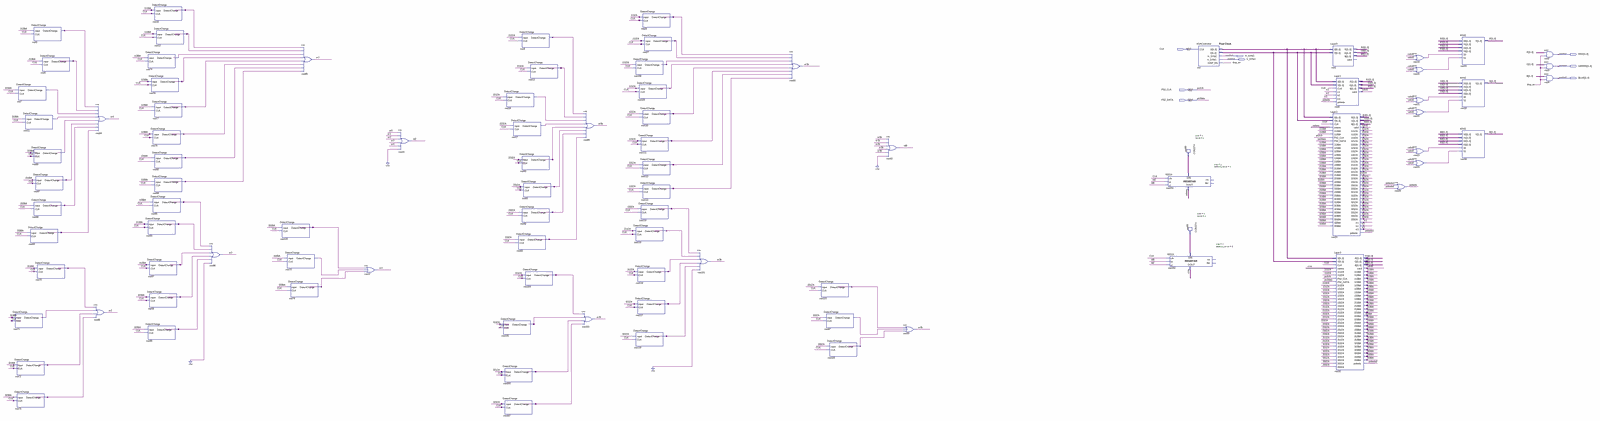
[diagram p0: schematic sheet, whole]
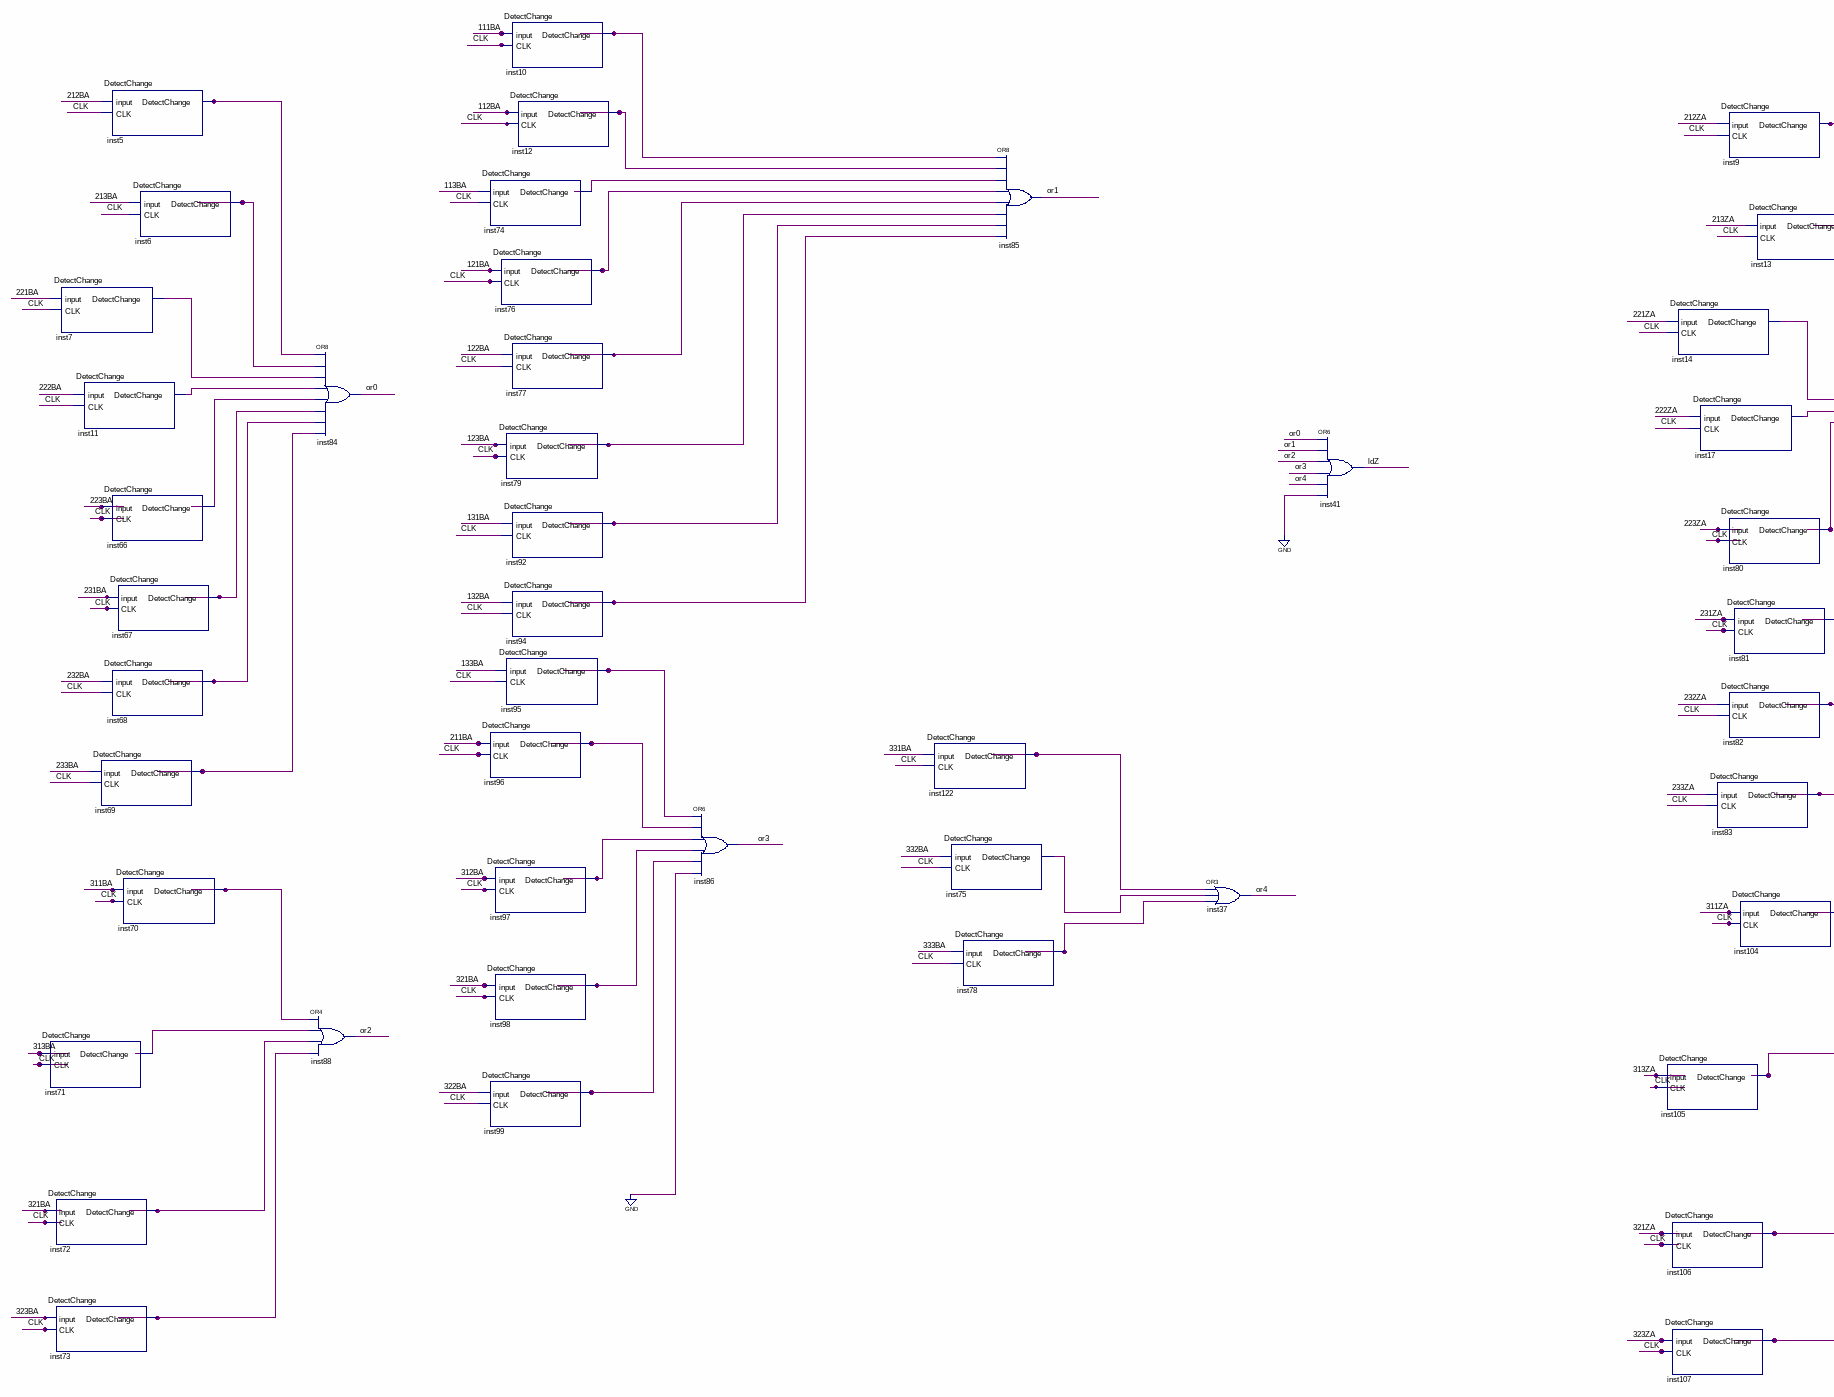
[diagram p1: schematic sheet, left part]
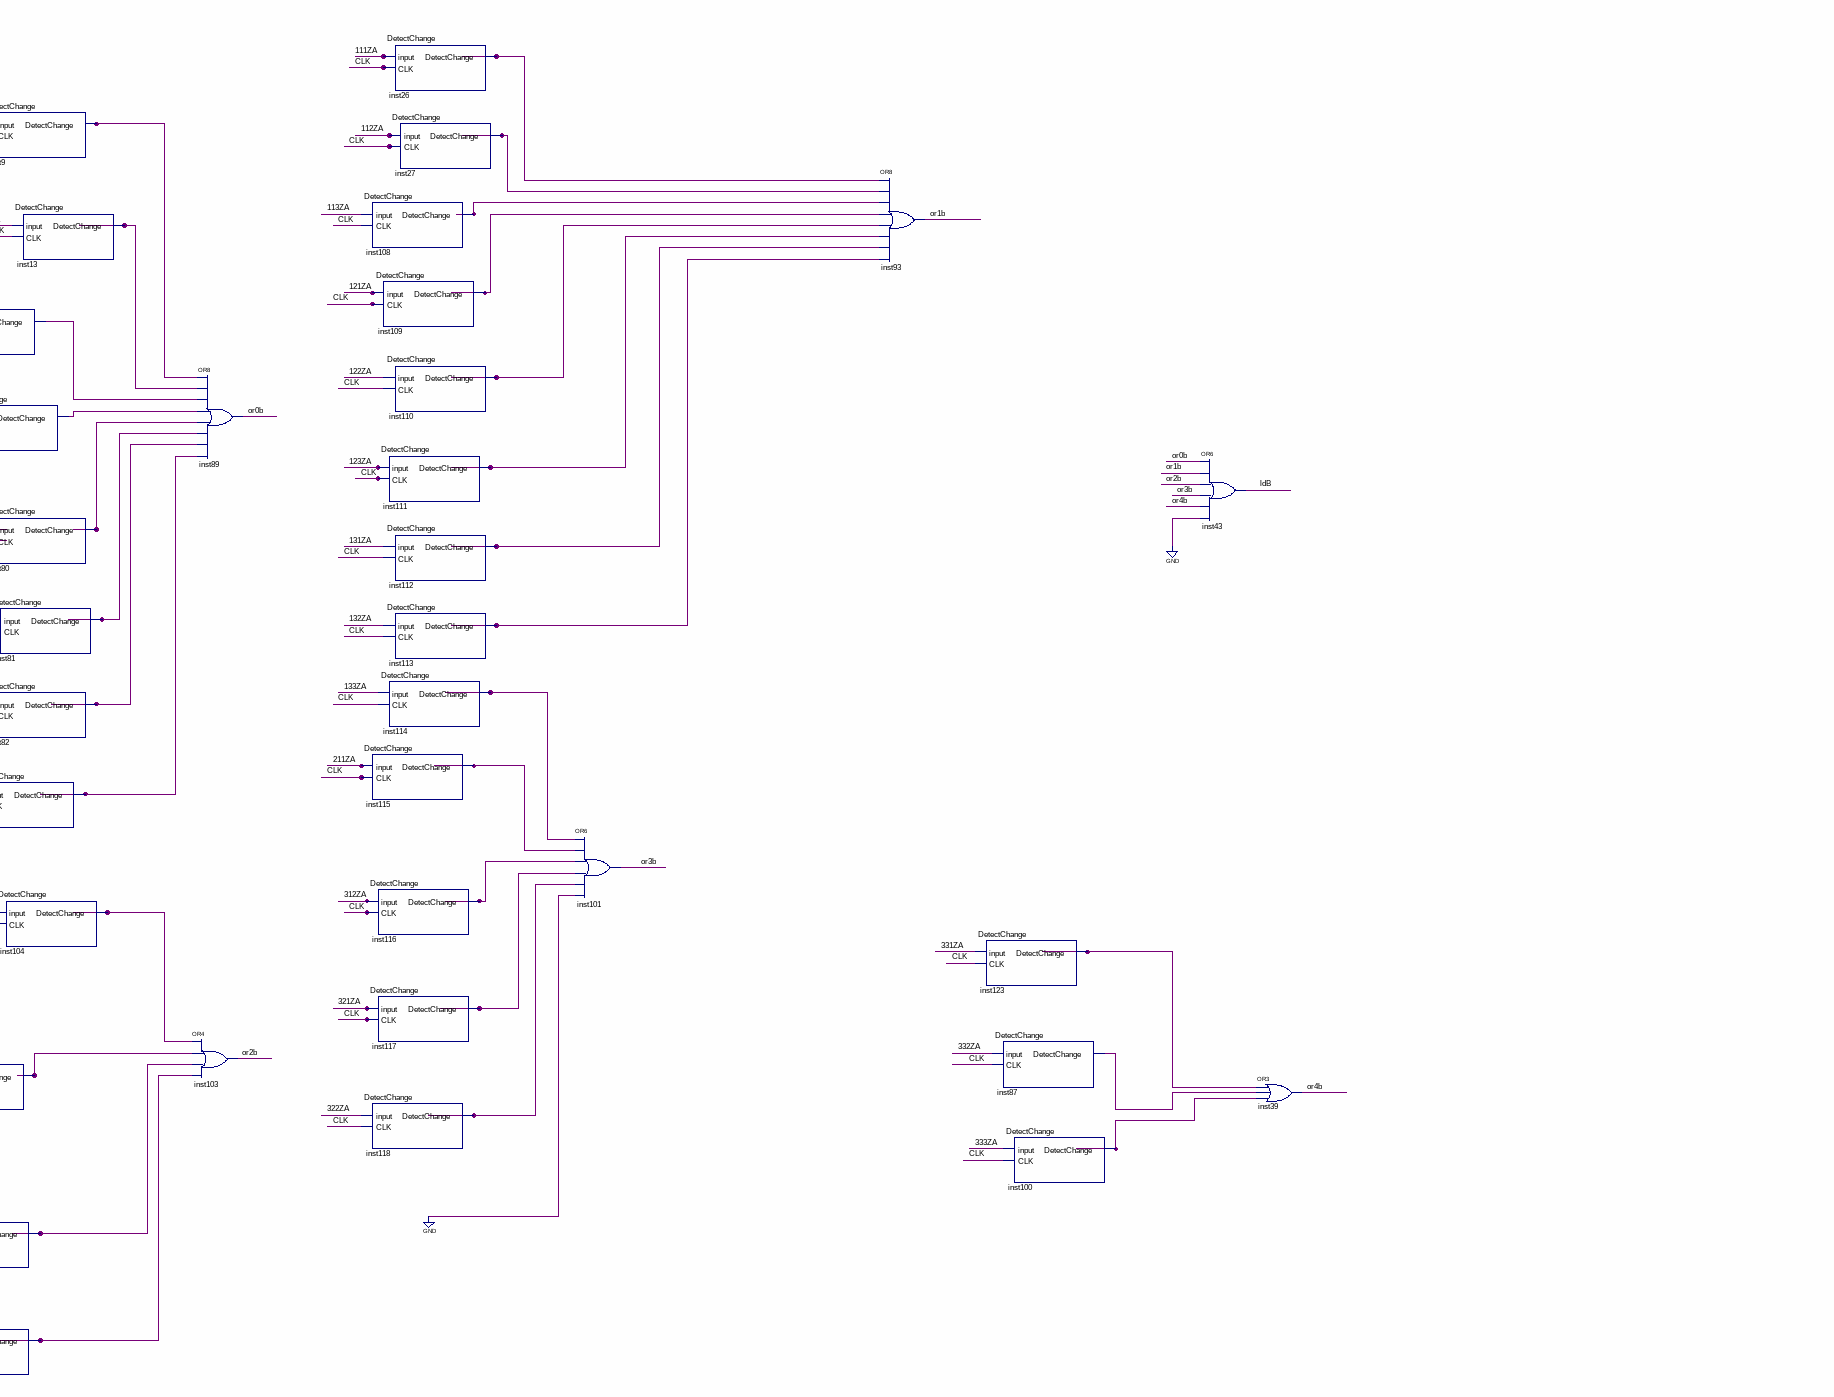
[diagram p2: schematic sheet, centre part]
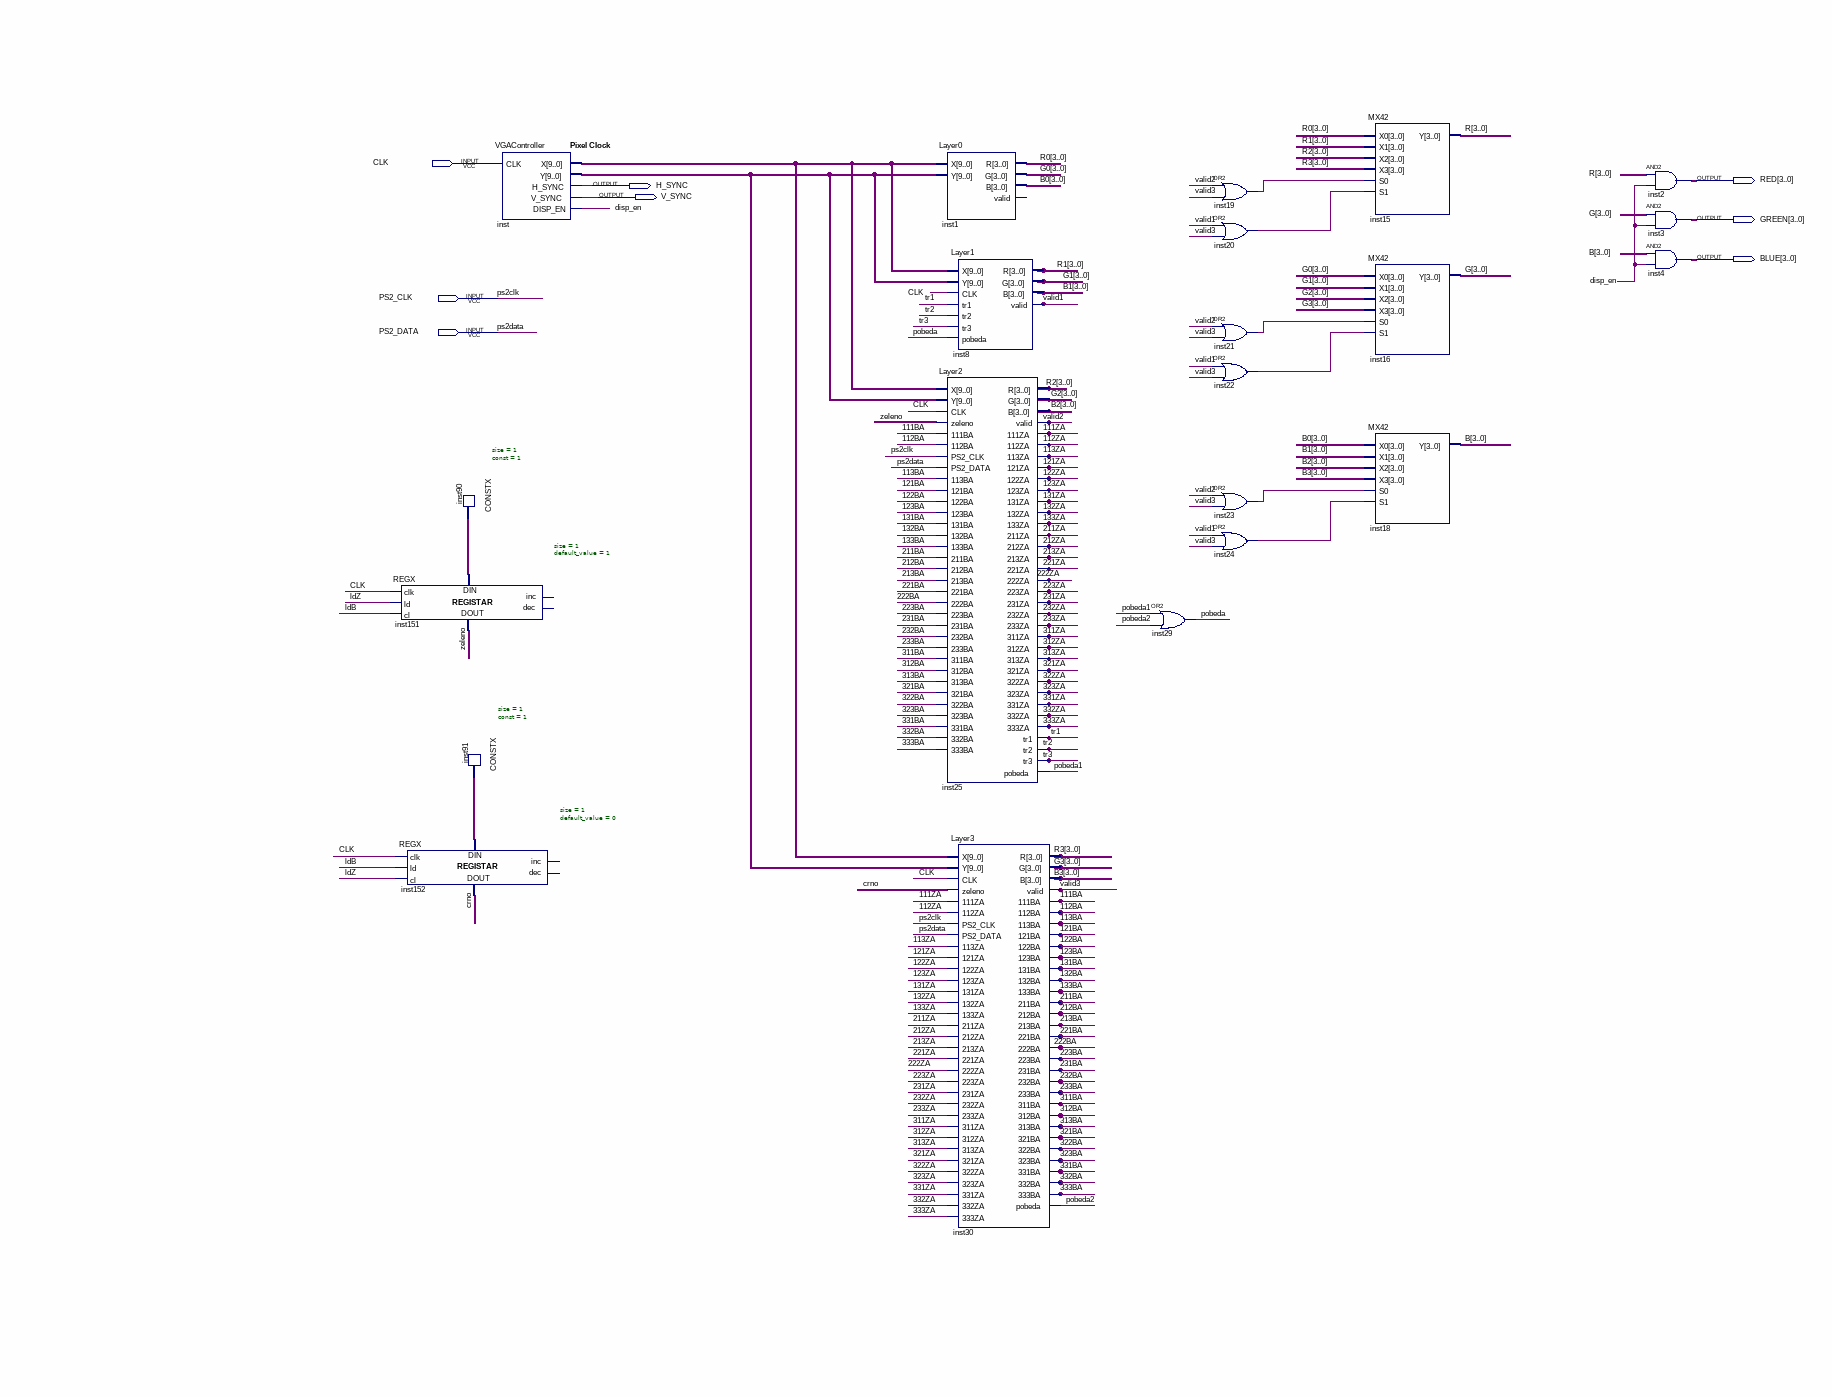
[diagram p3: schematic sheet, right part]
// Quartus schematic Lab2Demo.bdf as structural Verilog: 90 symbols, 8 pins
module Lab2Demo (
  input  CLK,
  input  PS2_CLK,
  input  PS2_DATA,
  output [3:0] RED,
  output H_SYNC,
  output V_SYNC,
  output [3:0] GREEN,
  output [3:0] BLUE
);

  wire \111BA , \111ZA , \112BA , \112ZA , \113BA , \113ZA , \121BA , \121ZA , \122BA , \122ZA , \123BA ,
       \123ZA , \131BA , \131ZA , \132BA , \132ZA , \133BA , \133ZA , \211BA , \211ZA , \212BA , \212ZA ,
       \213BA , \213ZA , \221BA , \221ZA , \222BA , \222ZA , \223BA , \223ZA , \231BA , \231ZA , \232BA ,
       \232ZA , \233BA , \233ZA , \311BA , \311ZA , \312BA , \312ZA , \313BA , \313ZA , \321BA , \321ZA ,
       \322BA , \322ZA , \323BA , \323ZA , \331BA , \331ZA , \332BA , \332ZA , \333BA , \333ZA , crno,
       disp_en, inst5_detectchange, inst6_detectchange, inst7_detectchange, inst9_detectchange,
       inst10_detectchange, inst11_detectchange, inst12_detectchange, inst13_detectchange,
       inst14_detectchange, inst17_detectchange, inst19_out, inst20_out, inst21_out, inst22_out, inst23_out,
       inst24_out, inst26_detectchange, inst27_detectchange, inst66_detectchange, inst67_detectchange,
       inst68_detectchange, inst69_detectchange, inst70_detectchange, inst71_detectchange,
       inst72_detectchange, inst73_detectchange, inst74_detectchange, inst75_detectchange,
       inst76_detectchange, inst77_detectchange, inst78_detectchange, inst79_detectchange,
       inst80_detectchange, inst81_detectchange, inst82_detectchange, inst83_detectchange,
       inst87_detectchange, inst90_data, inst91_data, inst92_detectchange, inst94_detectchange,
       inst95_detectchange, inst96_detectchange, inst97_detectchange, inst98_detectchange,
       inst99_detectchange, inst100_detectchange, inst104_detectchange, inst105_detectchange,
       inst106_detectchange, inst107_detectchange, inst108_detectchange, inst109_detectchange,
       inst110_detectchange, inst111_detectchange, inst112_detectchange, inst113_detectchange,
       inst114_detectchange, inst115_detectchange, inst116_detectchange, inst117_detectchange,
       inst118_detectchange, inst122_detectchange, inst123_detectchange, ldB, ldZ, or0, or0b, or1, or1b, or2,
       or2b, or3, or3b, or4, or4b, pobeda, pobeda1, pobeda2, tr1, tr2, tr3, valid1, valid2, valid3, zeleno;
  wire [3:0] B, B0, B1, B2, B3, G, G0, G1, G2, G3, R, R0, R1, R2, R3;
  wire [9:0] inst_x, inst_y;

  DetectChange inst71 (.\input (\313BA ), .CLK(CLK), .DetectChange(inst71_detectchange));
  DetectChange inst7 (.\input (\221BA ), .CLK(CLK), .DetectChange(inst7_detectchange));
  DetectChange inst11 (.\input (\222BA ), .CLK(CLK), .DetectChange(inst11_detectchange));
  DetectChange inst72 (.\input (\321BA ), .CLK(CLK), .DetectChange(inst72_detectchange));
  DetectChange inst73 (.\input (\323BA ), .CLK(CLK), .DetectChange(inst73_detectchange));
  DetectChange inst5 (.\input (\212BA ), .CLK(CLK), .DetectChange(inst5_detectchange));
  DetectChange inst6 (.\input (\213BA ), .CLK(CLK), .DetectChange(inst6_detectchange));
  DetectChange inst66 (.\input (\223BA ), .CLK(CLK), .DetectChange(inst66_detectchange));
  DetectChange inst67 (.\input (\231BA ), .CLK(CLK), .DetectChange(inst67_detectchange));
  DetectChange inst68 (.\input (\232BA ), .CLK(CLK), .DetectChange(inst68_detectchange));
  DetectChange inst69 (.\input (\233BA ), .CLK(CLK), .DetectChange(inst69_detectchange));
  DetectChange inst70 (.\input (\311BA ), .CLK(CLK), .DetectChange(inst70_detectchange));
  or inst88 (or2, inst70_detectchange, inst71_detectchange, inst72_detectchange, inst73_detectchange);
  or inst84 (or0, inst5_detectchange, inst6_detectchange, inst7_detectchange, inst11_detectchange, inst66_detectchange, inst67_detectchange, inst68_detectchange, inst69_detectchange);
  DetectChange inst74 (.\input (\113BA ), .CLK(CLK), .DetectChange(inst74_detectchange));
  DetectChange inst76 (.\input (\121BA ), .CLK(CLK), .DetectChange(inst76_detectchange));
  DetectChange inst96 (.\input (\211BA ), .CLK(CLK), .DetectChange(inst96_detectchange));
  DetectChange inst97 (.\input (\312BA ), .CLK(CLK), .DetectChange(inst97_detectchange));
  DetectChange inst98 (.\input (\321BA ), .CLK(CLK), .DetectChange(inst98_detectchange));
  DetectChange inst99 (.\input (\322BA ), .CLK(CLK), .DetectChange(inst99_detectchange));
  DetectChange inst10 (.\input (\111BA ), .CLK(CLK), .DetectChange(inst10_detectchange));
  DetectChange inst12 (.\input (\112BA ), .CLK(CLK), .DetectChange(inst12_detectchange));
  DetectChange inst77 (.\input (\122BA ), .CLK(CLK), .DetectChange(inst77_detectchange));
  DetectChange inst79 (.\input (\123BA ), .CLK(CLK), .DetectChange(inst79_detectchange));
  DetectChange inst92 (.\input (\131BA ), .CLK(CLK), .DetectChange(inst92_detectchange));
  DetectChange inst94 (.\input (\132BA ), .CLK(CLK), .DetectChange(inst94_detectchange));
  DetectChange inst95 (.\input (\133BA ), .CLK(CLK), .DetectChange(inst95_detectchange));
  or inst86 (or3, inst95_detectchange, inst96_detectchange, inst97_detectchange, inst98_detectchange, inst99_detectchange, 1'b0);
  DetectChange inst122 (.\input (\331BA ), .CLK(CLK), .DetectChange(inst122_detectchange));
  DetectChange inst75 (.\input (\332BA ), .CLK(CLK), .DetectChange(inst75_detectchange));
  DetectChange inst78 (.\input (\333BA ), .CLK(CLK), .DetectChange(inst78_detectchange));
  or inst85 (or1, inst10_detectchange, inst12_detectchange, inst74_detectchange, inst76_detectchange, inst77_detectchange, inst79_detectchange, inst92_detectchange, inst94_detectchange);
  or inst37 (or4, inst122_detectchange, inst75_detectchange, inst78_detectchange);
  or inst41 (ldZ, or0, or1, or2, or3, or4, 1'b0);
  DetectChange inst105 (.\input (\313ZA ), .CLK(CLK), .DetectChange(inst105_detectchange));
  DetectChange inst106 (.\input (\321ZA ), .CLK(CLK), .DetectChange(inst106_detectchange));
  DetectChange inst107 (.\input (\323ZA ), .CLK(CLK), .DetectChange(inst107_detectchange));
  DetectChange inst14 (.\input (\221ZA ), .CLK(CLK), .DetectChange(inst14_detectchange));
  DetectChange inst17 (.\input (\222ZA ), .CLK(CLK), .DetectChange(inst17_detectchange));
  DetectChange inst83 (.\input (\233ZA ), .CLK(CLK), .DetectChange(inst83_detectchange));
  DetectChange inst9 (.\input (\212ZA ), .CLK(CLK), .DetectChange(inst9_detectchange));
  DetectChange inst13 (.\input (\213ZA ), .CLK(CLK), .DetectChange(inst13_detectchange));
  DetectChange inst80 (.\input (\223ZA ), .CLK(CLK), .DetectChange(inst80_detectchange));
  DetectChange inst81 (.\input (\231ZA ), .CLK(CLK), .DetectChange(inst81_detectchange));
  DetectChange inst82 (.\input (\232ZA ), .CLK(CLK), .DetectChange(inst82_detectchange));
  DetectChange inst104 (.\input (\311ZA ), .CLK(CLK), .DetectChange(inst104_detectchange));
  or inst89 (or0b, inst9_detectchange, inst13_detectchange, inst14_detectchange, inst17_detectchange, inst80_detectchange, inst81_detectchange, inst82_detectchange, inst83_detectchange);
  or inst103 (or2b, inst104_detectchange, inst105_detectchange, inst106_detectchange, inst107_detectchange);
  DetectChange inst108 (.\input (\113ZA ), .CLK(CLK), .DetectChange(inst108_detectchange));
  DetectChange inst109 (.\input (\121ZA ), .CLK(CLK), .DetectChange(inst109_detectchange));
  DetectChange inst111 (.\input (\123ZA ), .CLK(CLK), .DetectChange(inst111_detectchange));
  DetectChange inst114 (.\input (\133ZA ), .CLK(CLK), .DetectChange(inst114_detectchange));
  DetectChange inst115 (.\input (\211ZA ), .CLK(CLK), .DetectChange(inst115_detectchange));
  DetectChange inst116 (.\input (\312ZA ), .CLK(CLK), .DetectChange(inst116_detectchange));
  DetectChange inst117 (.\input (\321ZA ), .CLK(CLK), .DetectChange(inst117_detectchange));
  DetectChange inst118 (.\input (\322ZA ), .CLK(CLK), .DetectChange(inst118_detectchange));
  DetectChange inst26 (.\input (\111ZA ), .CLK(CLK), .DetectChange(inst26_detectchange));
  DetectChange inst27 (.\input (\112ZA ), .CLK(CLK), .DetectChange(inst27_detectchange));
  DetectChange inst110 (.\input (\122ZA ), .CLK(CLK), .DetectChange(inst110_detectchange));
  DetectChange inst112 (.\input (\131ZA ), .CLK(CLK), .DetectChange(inst112_detectchange));
  DetectChange inst113 (.\input (\132ZA ), .CLK(CLK), .DetectChange(inst113_detectchange));
  or inst101 (or3b, inst114_detectchange, inst115_detectchange, inst116_detectchange, inst117_detectchange, inst118_detectchange, 1'b0);
  or inst93 (or1b, inst26_detectchange, inst27_detectchange, inst108_detectchange, inst109_detectchange, inst110_detectchange, inst111_detectchange, inst112_detectchange, inst113_detectchange);
  DetectChange inst123 (.\input (\331ZA ), .CLK(CLK), .DetectChange(inst123_detectchange));
  DetectChange inst87 (.\input (\332ZA ), .CLK(CLK), .DetectChange(inst87_detectchange));
  DetectChange inst100 (.\input (\333ZA ), .CLK(CLK), .DetectChange(inst100_detectchange));
  or inst43 (ldB, or0b, or1b, or2b, or3b, or4b, 1'b0);
  or inst39 (or4b, inst123_detectchange, inst87_detectchange, inst100_detectchange);
  REGX #(.size(1), .default_value(1)) inst151 (
    .clk(CLK), .ld(ldZ), .cl(ldB), .data_in(inst90_data), .data_out(zeleno));  // open: inc, dec
  REGX #(.size(1), .default_value(0)) inst152 (
    .clk(CLK), .ld(ldB), .cl(ldZ), .data_in(inst91_data), .data_out(crno));  // open: inc, dec
  VGAController inst (.CLK(CLK), .X(inst_x), .Y(inst_y), .H_SYNC(H_SYNC), .V_SYNC(V_SYNC), .DISP_EN(disp_en));
  CONSTX #(.size(1), .\const (1)) inst90 (.data(inst90_data));
  CONSTX #(.size(1), .\const (1)) inst91 (.data(inst91_data));
  Layer0 inst1 (.X(inst_x), .Y(inst_y), .R(R0), .G(G0), .B(B0));  // open: valid
  Layer2 inst25 (
    .X(inst_x), .Y(inst_y), .CLK(CLK), .zeleno(zeleno), .\111BA (\111BA ), .\112BA (\112BA ),
    .PS2_CLK(PS2_CLK), .PS2_DATA(PS2_DATA), .\113BA (\113BA ), .\121BA (\121BA ), .\122BA (\122BA ),
    .\123BA (\123BA ), .\131BA (\131BA ), .\132BA (\132BA ), .\133BA (\133BA ), .\211BA (\211BA ),
    .\212BA (\212BA ), .\213BA (\213BA ), .\221BA (\221BA ), .\222BA (\222BA ), .\223BA (\223BA ),
    .\231BA (\231BA ), .\232BA (\232BA ), .\233BA (\233BA ), .\311BA (\311BA ), .\312BA (\312BA ),
    .\313BA (\313BA ), .\321BA (\321BA ), .\322BA (\322BA ), .\323BA (\323BA ), .\331BA (\331BA ),
    .\332BA (\332BA ), .\333BA (\333BA ), .R(R2), .G(G2), .B(B2), .valid(valid2), .\111ZA (\111ZA ),
    .\112ZA (\112ZA ), .\113ZA (\113ZA ), .\121ZA (\121ZA ), .\122ZA (\122ZA ), .\123ZA (\123ZA ),
    .\131ZA (\131ZA ), .\132ZA (\132ZA ), .\133ZA (\133ZA ), .\211ZA (\211ZA ), .\212ZA (\212ZA ),
    .\213ZA (\213ZA ), .\221ZA (\221ZA ), .\222ZA (\222ZA ), .\223ZA (\223ZA ), .\231ZA (\231ZA ),
    .\232ZA (\232ZA ), .\233ZA (\233ZA ), .\311ZA (\311ZA ), .\312ZA (\312ZA ), .\313ZA (\313ZA ),
    .\321ZA (\321ZA ), .\322ZA (\322ZA ), .\323ZA (\323ZA ), .\331ZA (\331ZA ), .\332ZA (\332ZA ),
    .\333ZA (\333ZA ), .tr1(tr1), .tr2(tr2), .tr3(tr3), .pobeda(pobeda1));
  Layer1 inst8 (
    .X(inst_x), .Y(inst_y), .CLK(CLK), .tr1(tr1), .tr2(tr2), .tr3(tr3), .pobeda(pobeda), .R(R1), .G(G1),
    .B(B1), .valid(valid1));
  Layer3 inst30 (
    .X(inst_x), .Y(inst_y), .CLK(CLK), .zeleno(crno), .\111ZA (\111ZA ), .\112ZA (\112ZA ),
    .PS2_CLK(PS2_CLK), .PS2_DATA(PS2_DATA), .\113ZA (\113ZA ), .\121ZA (\121ZA ), .\122ZA (\122ZA ),
    .\123ZA (\123ZA ), .\131ZA (\131ZA ), .\132ZA (\132ZA ), .\133ZA (\133ZA ), .\211ZA (\211ZA ),
    .\212ZA (\212ZA ), .\213ZA (\213ZA ), .\221ZA (\221ZA ), .\222ZA (\222ZA ), .\223ZA (\223ZA ),
    .\231ZA (\231ZA ), .\232ZA (\232ZA ), .\233ZA (\233ZA ), .\311ZA (\311ZA ), .\312ZA (\312ZA ),
    .\313ZA (\313ZA ), .\321ZA (\321ZA ), .\322ZA (\322ZA ), .\323ZA (\323ZA ), .\331ZA (\331ZA ),
    .\332ZA (\332ZA ), .\333ZA (\333ZA ), .R(R3), .G(G3), .B(B3), .valid(valid3), .\111BA (\111BA ),
    .\112BA (\112BA ), .\113BA (\113BA ), .\121BA (\121BA ), .\122BA (\122BA ), .\123BA (\123BA ),
    .\131BA (\131BA ), .\132BA (\132BA ), .\133BA (\133BA ), .\211BA (\211BA ), .\212BA (\212BA ),
    .\213BA (\213BA ), .\221BA (\221BA ), .\222BA (\222BA ), .\223BA (\223BA ), .\231BA (\231BA ),
    .\232BA (\232BA ), .\233BA (\233BA ), .\311BA (\311BA ), .\312BA (\312BA ), .\313BA (\313BA ),
    .\321BA (\321BA ), .\322BA (\322BA ), .\323BA (\323BA ), .\331BA (\331BA ), .\332BA (\332BA ),
    .\333BA (\333BA ), .pobeda(pobeda2));
  or inst29 (pobeda, pobeda1, pobeda2);
  or inst19 (inst19_out, valid2, valid3);
  or inst20 (inst20_out, valid1, valid3);
  or inst21 (inst21_out, valid2, valid3);
  or inst22 (inst22_out, valid1, valid3);
  or inst23 (inst23_out, valid2, valid3);
  or inst24 (inst24_out, valid1, valid3);
  MX42 inst15 (.X0(R0), .X1(R1), .X2(R2), .X3(R3), .S0(inst19_out), .S1(inst20_out), .Y(R));
  MX42 inst16 (.X0(G0), .X1(G1), .X2(G2), .X3(G3), .S0(inst21_out), .S1(inst22_out), .Y(G));
  MX42 inst18 (.X0(B0), .X1(B1), .X2(B2), .X3(B3), .S0(inst23_out), .S1(inst24_out), .Y(B));
  assign RED = R & {4{disp_en}};  // AND2 inst2, 4 bits wide
  assign GREEN = G & {4{disp_en}};  // AND2 inst3, 4 bits wide
  assign BLUE = B & {4{disp_en}};  // AND2 inst4, 4 bits wide

  // Other names for the same wires on the sheet: ps2clk = PS2_CLK; ps2data = PS2_DATA

  // Notes on the sheet:
  //   Pixel Clock
endmodule
